# EAGLE design Seeeduino-v4.2 (EAGLE 6.5.0)
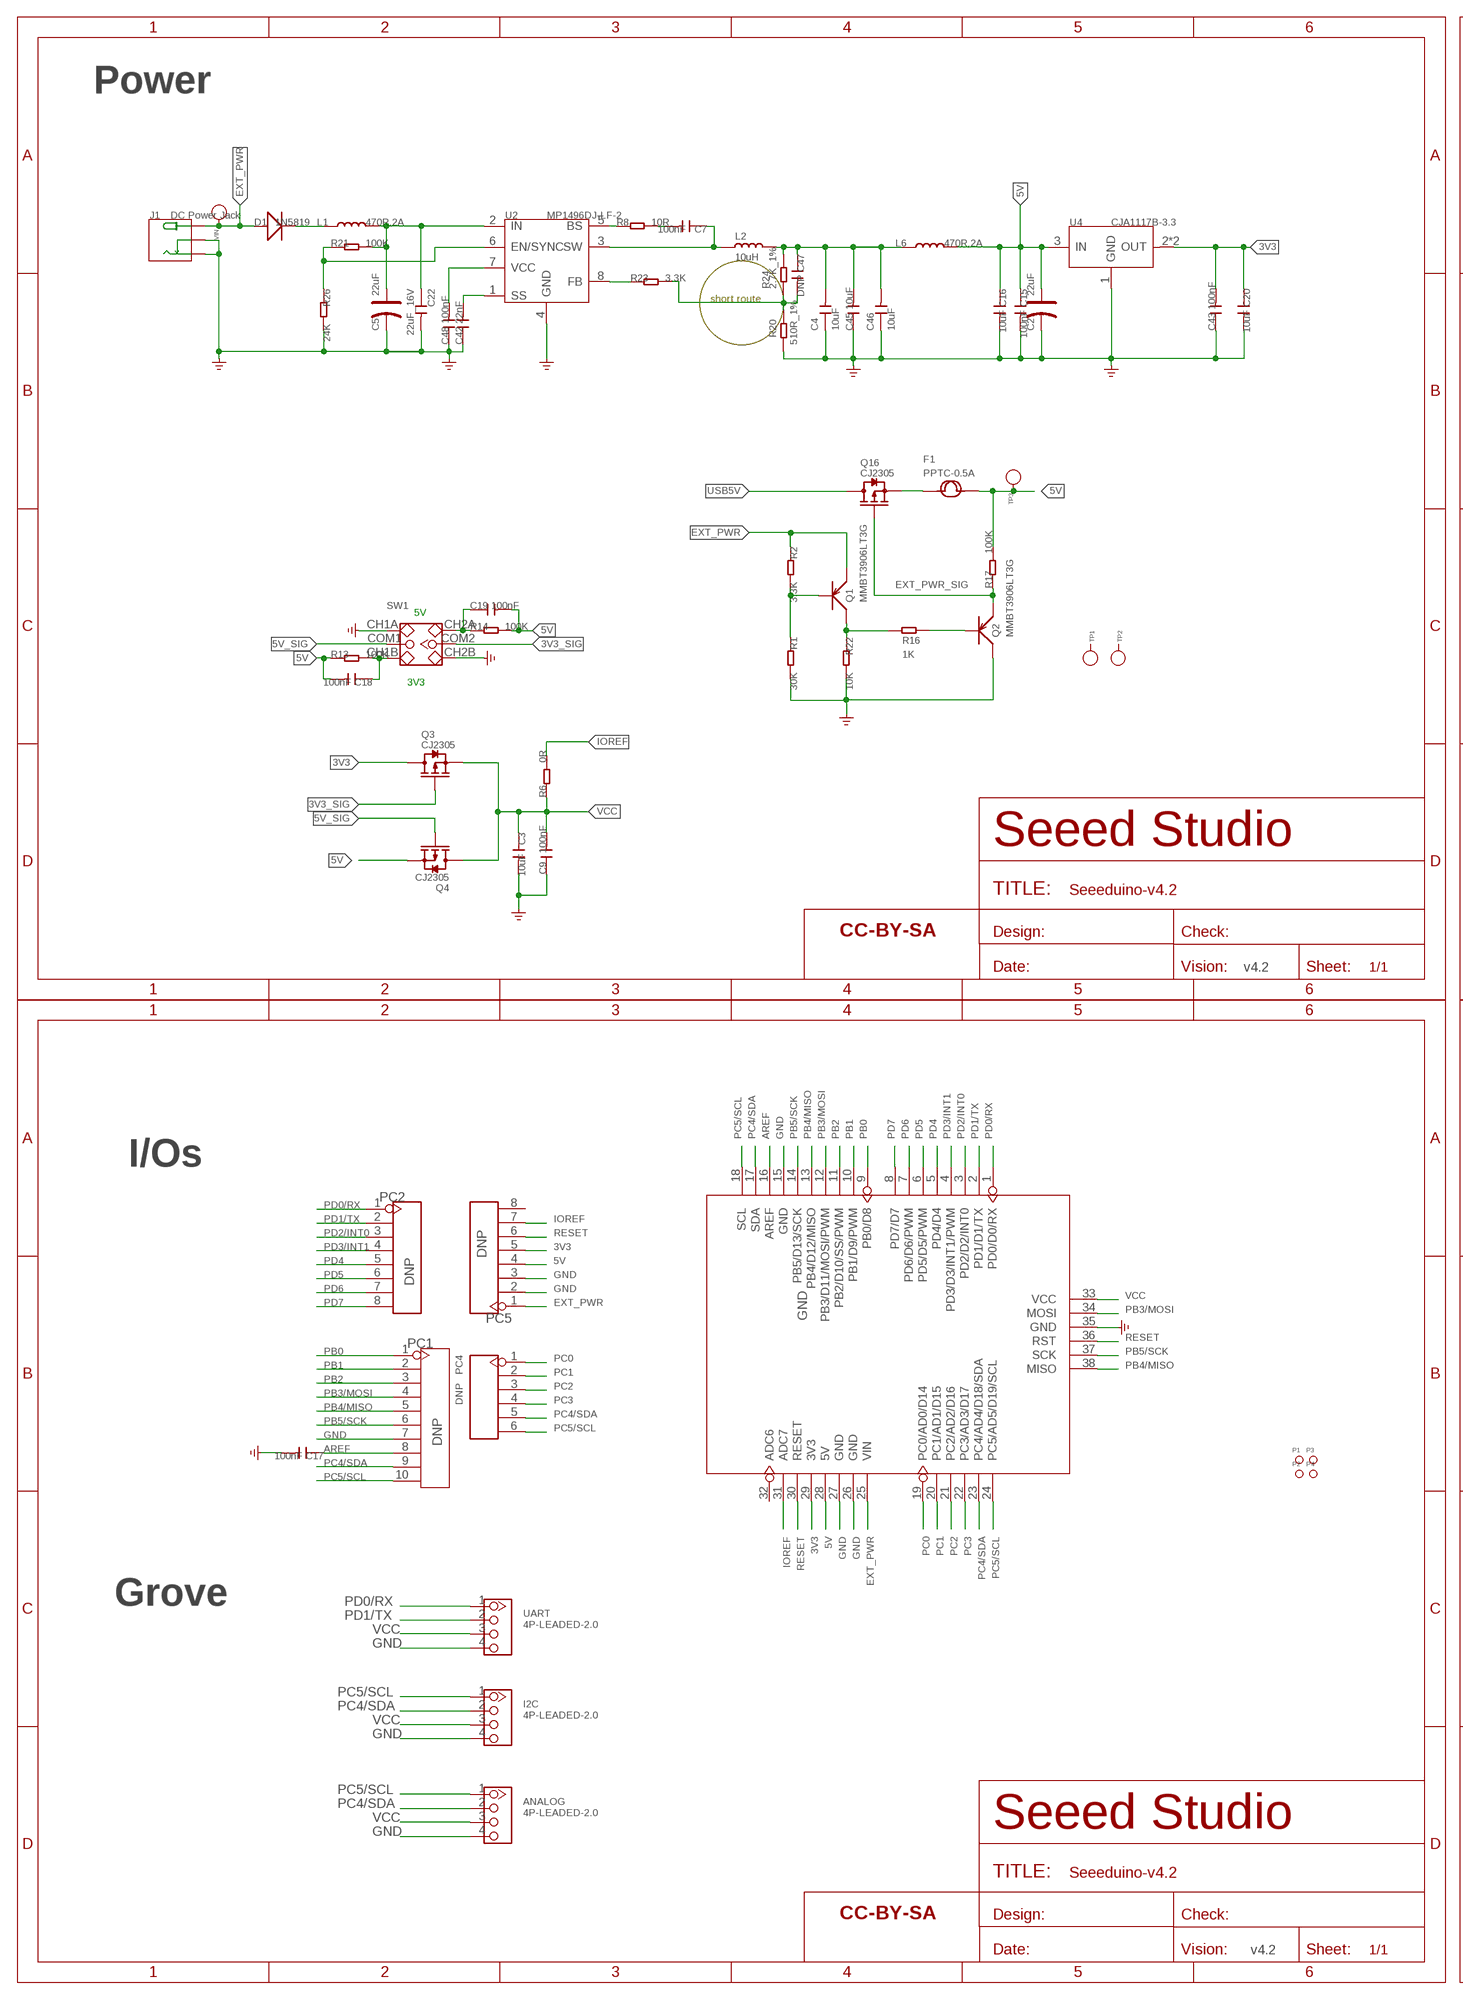
[diagram p0: schematic, sheet 1, part 1 of 2]
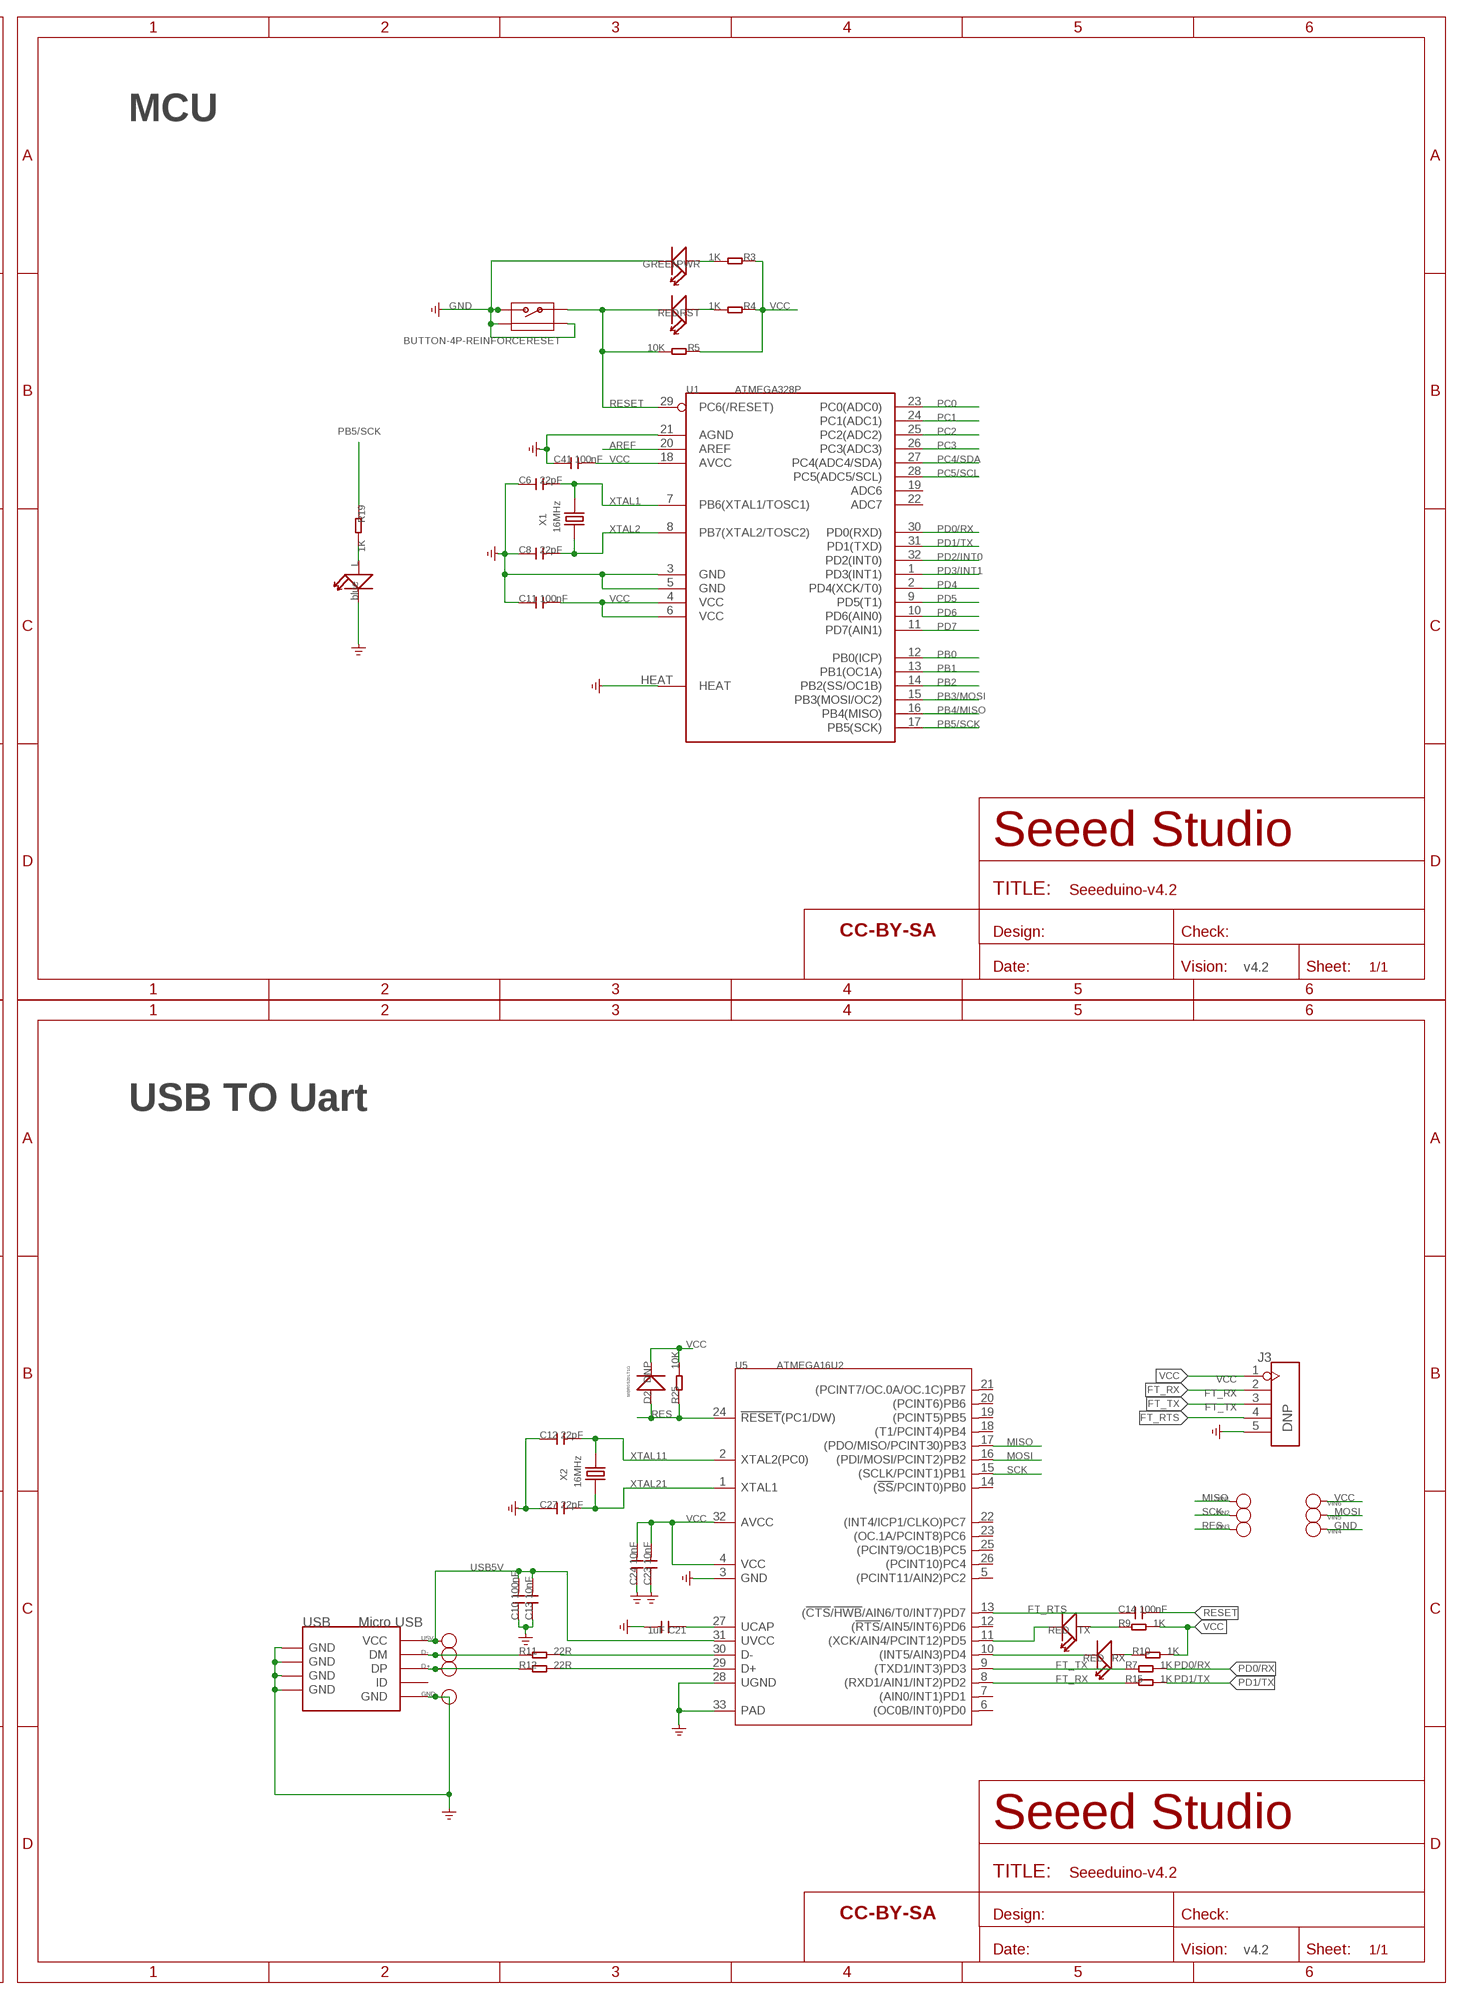
[diagram p1: schematic, sheet 1, part 2 of 2]

## Parts
ANALOG  4P-LEADED-2.0  TWIG-2.0-LEADED  [4P-LEADED-2.0]
C2  22uF  CAP-POLAR-ELECTRO-B  [ELECTRO-SMD-B-4.8MM]
C3  10uF  C-0805  [C0805]
C4  10uF  CAP-0805  [C0805]
C5  22uF  CAP-POLAR-ELECTRO-B  [ELECTRO-SMD-B-4.8MM]
C6  22pF  C-0603  [C0603]
C7  100nF  C-0603  [C0603]
C8  22pF  C-0603  [C0603]
C9  100nF  C-0603  [C0603]
C10  100nF  C-0603  [C0603]
C11  100nF  C-0603  [C0603]
C12  22pF  C-0603  [C0603]
C13  10nF  C-0603  [C0603]
C14  100nF  C-0603  [C0603]
C15  100nF  C-0603  [C0603]
C16  10uF  C-0805  [C0805]
C17  100nF  C-0603  [C0603]
C18  100nF  C-0603  [C0603]
C19  100nF  C-0603  [C0603]
C20  10uF  C-0805  [C0805]
C21  1uF  C-0603  [C0603]
C22  22uF_16V  CAP-1206  [C1206]
C23  10nF  C-0603  [C0603]
C24  10nF  C-0603  [C0603]
C27  22pF  C-0603  [C0603]
C41  100nF  C-0603  [C0603]
C42  22nF  C-0603  [C0603]
C43  100nF  C-0603  [C0603]
C45  10uF  C-0805  [C0805]
C46  10uF  CAP-1206  [C1206]
C47  DNP  C-0603  [C0603]
C48  100nF  C-0603  [C0603]
D1  1N5819  D'DO-214AC'  [D2010]
D2  DNP  D'1206'  [SOD123]
D+  PAD-TEST-POINT'4545'  [TP_4545]
D-  PAD-TEST-POINT'4545'  [TP_4545]
F1  PPTC-0.5A  FUSE'1206'  [F1206]
GND  PAD-TEST-POINT'4545'  [TP_4545]
I2C  4P-LEADED-2.0  TWIG-2.0-LEADED  [4P-LEADED-2.0]
J1  DC Power Jack  DC-044  [DC-404]
J3  DNP  HEADER-5P-2.54  [5P-2.54]
L  blue  LED'0603'  [LED-0603]
L1  470R,2A  L'0805'  [L0805]
L2  10uH  INDUCTOR/FERRITE-BEAD5040S  [L5040S]
L6  470R,2A  L'0805'  [L0805]
P1  PAD-MARK  [ROUND-MARK-1.0]
P2  PAD-MARK  [ROUND-MARK-1.0]
P3  PAD-MARK  [ROUND-MARK-1.0]
P4  PAD-MARK  [ROUND-MARK-1.0]
PC1  DNP  HEADER-10P-2.54  [10P-2.54]
PC2  DNP  HEADER-8P-2.54  [8P-2.54]
PC4  DNP  HEADER-6P-65/35MIL  [6P-2.54-65/35MIL]
PC5  DNP  HEADER-8P-2.54  [8P-2.54]
PWR  GREEN  LED'0603'  [LED-0603]
Q1  MMBT3906LT3G  TRANSISTOR-PNP-SOT23  [SOT23]
Q2  MMBT3906LT3G  TRANSISTOR-PNP-SOT23  [SOT23]
Q3  CJ2305  MOSFET-P'SI2323CDS/SI2305DS<BR>'  [SOT23]
Q4  CJ2305  MOSFET-P'SI2323CDS/SI2305DS<BR>'  [SOT23]
Q16  CJ2305  MOSFET-P'SI2323CDS/SI2305DS<BR>'  [SOT23]
R1  30K  R-0603  [R0603]
R2  3.3K  R-0603  [R0603]
R3  1K  R-0603  [R0603]
R4  1K  R-0603  [R0603]
R5  10K  R-0603  [R0603]
R6  0R  R-0603  [R0603]
R7  1K  R-0603  [R0603]
R8  10R  R-0603  [R0603]
R9  1K  R-0603  [R0603]
R10  1K  R-0603  [R0603]
R11  22R  R-0603  [R0603]
R12  22R  R-0603  [R0603]
R13  100K  R-0603  [R0603]
R14  100K  R-0603  [R0603]
R15  1K  R-0603  [R0603]
R16  1K  R-0603  [R0603]
R17  100K  R-0603  [R0603]
R19  1K  R-0603  [R0603]
R20  510R_1%  R-0603  [R0603]
R21  100K  R-0603  [R0603]
R22  10K  R-0603  [R0603]
R23  3.3K  R-0603  [R0603]
R24  2.7K_1%  R-0603  [R0603]
R25  10K  R-0603  [R0603]
R26  24K  R-0603  [R0603]
RESET  BUTTON-4P-REINFORCE  BUTTON-4P-REINFORCE'TS-1188E'  [4P-SMD-7X3.5X3.5H]
RST  RED  LED'0603'  [LED-0603]
RX  RED  LED'0603'  [LED-0603]
SW1  SWITCH-2CH-6P-2.54  SWITCH-2CH-6P-SMD  [6P-SMD-2CH-2.54-3.5X7.2]
TP1  PAD-TEST-POINT'4545'  [TP_4545]
TP2  PAD-TEST-POINT'4545'  [TP_4545]
TP3  PAD-TEST-POINT'4545'  [TP_4545]
TX  RED  LED'0603'  [LED-0603]
U1  ATMEGA328P  MEGA8  [MLF32X]
U2  MP1496DJ-LF-2  MP1496DJ  [TSOT23-8]
U3  ARDUINO-38P  [ARDUINO-38P]
U4  CJA1117B-3.3  PMIC-CJ1117'SOT89'  [SOT-89]
U5  ATMEGA16U2  [QFN32]
U5V  PAD-TEST-POINT'4545'  [TP_4545]
U$1  SEEEDSTUDIO-OPEN-SCH-FRAME  [SEEEDSTUDIO-PCB-FRAME]
U$6  SEEEDSTUDIO-OPEN-SCH-FRAME  [SEEEDSTUDIO-PCB-FRAME]
U$8  SEEEDSTUDIO-OPEN-SCH-FRAME  [SEEEDSTUDIO-PCB-FRAME]
U$23  SEEEDSTUDIO-OPEN-SCH-FRAME  [SEEEDSTUDIO-PCB-FRAME]
UART  4P-LEADED-2.0  TWIG-2.0-LEADED  [4P-LEADED-2.0]
USB  Micro USB  USB-MINIUSB-5P-MICRO  [MICRO-USB]
VIN  PAD-TEST-POINT'4545'  [TP_4545]
VIN1  PAD-TEST-POINT'4545'  [TP_4545]
VIN2  PAD-TEST-POINT'4545'  [TP_4545]
VIN3  PAD-TEST-POINT'4545'  [TP_4545]
VIN4  PAD-TEST-POINT'4545'  [TP_4545]
VIN5  PAD-TEST-POINT'4545'  [TP_4545]
VIN6  PAD-TEST-POINT'4545'  [TP_4545]
X1  16MHz  CRYSTAL'5032'  [2P-SMD-5X3.2]
X2  16MHz  CRYSTAL'5032'  [2P-SMD-5X3.2]

## Nets
3V3: C20.1 C43.2 PC5.5 Q3.3(D) U3.29(3V3) U4.2(OUT) U4.4(OUT)
3V3_SIG: Q3.1(G) SW1.COM2
5V: C2.+ C15.1 C16.1 C18.2 C19.2 F1.2 L6.2 PC5.4 Q4.2(S) R13.1 R14.2 R17.2 TP3.T U3.28(5V) U4.3(IN)
5V_SIG: Q4.1(G) SW1.COM1
AREF: C17.1 PC1.8 U1.20(AREF) U3.16(AREF)
D+: D+.T R12.1 USB.3(DP)
D-: D-.T R11.1 USB.2(DM)
EXT_PWR: D1.+ J1.+ PC5.1 Q1.2(E) R2.1 U3.25(VIN) VIN.T
EXT_PWR_SIG: Q2.2(E) Q16.1(G) R17.1
FT_RTS: C14.1 J3.4 U5.13((!CTS!/!HWB!/AIN6/T0/INT7)PD7)
FT_RX: J3.2 R15.1 U5.8((RXD1/AIN1/INT2)PD2)
FT_TX: J3.3 R7.1 U5.9((TXD1/INT3)PD3)
GND: ANALOG.4 C2.- C3.2 C4.1 C5.- C6.1 C8.1 C9.1 C10.1 C11.1 C12.1 C13.1 C15.2 C16.2 C17.2 C20.2 C21.2 C22.2 C23.1 C24.1 C27.1 C41.1 C42.1 C43.1 C45.1 C46.1 C48.1 GND.T I2C.4 J1.- J1.CDN J3.5 L.- PC1.7 PC5.2 PC5.3 PWR.- Q2.3(C) R1.2 R20.1 R22.2 R26.2 RESET.2 RESET.S1 RESET.S2 SW1.CH1A SW1.CH2B U1.3(GND) U1.5(GND) U1.21(AGND) U1.HEAT U2.4(GND) U3.15(GND) U3.26(GND) U3.27(GND) U3.35(GND) U4.1(GND) U5.3(GND) U5.28(UGND) U5.33(PAD) UART.4 USB.5(GND) USB.S1(GND) USB.S2(GND) USB.S3(GND) USB.S4(GND) USB.S5(GND) USB.S6(GND) VIN4.T ; supply symbol labelled GND_POWER
IOREF: PC5.7 R6.2 U3.31(ADC7)
MISO: U5.17((PDO/MISO/PCINT30)PB3) VIN1.T
MOSI: U5.16((PDI/MOSI/PCINT2)PB2) VIN5.T
N$1: TX.- U5.11((XCK/AIN4/PCINT12)PD5)
N$2: R21.1 R26.1 U2.6(EN/SYNC)
N$3: L.+ R19.2
N$5: Q1.1(B) R1.1 R2.2
N$6: R11.2 U5.30(D-)
N$7: PWR.+ R3.2
N$8: Q2.1(B) R16.2
N$9: Q1.3(C) R16.1 R22.1
N$10: D1.- L1.1
N$11: C18.1 R13.2 SW1.CH1B
N$12: R10.1 RX.+
N$13: R12.2 U5.29(D+)
N$14: RX.- U5.10((INT5/AIN3)PD4)
N$15: C19.1 R14.1 SW1.CH2A
N$17: R4.2 RST.+
N$18: C21.1 U5.27(UCAP)
N$20: C48.2 U2.7(VCC)
N$21: C42.2 U2.1(SS)
N$22: R8.1 U2.5(BS)
N$23: C7.1 L2.1 U2.3(SW)
N$24: C7.2 R8.2
N$25: R23.1 U2.8(FB)
N$27: C47.2 R20.2 R23.2 R24.2
N$32: R9.1 TX.+
OUT1: C4.2 C45.2 C46.2 C47.1 L2.2 L6.1 R24.1
P5V [usbvcc]: F1.1 Q16.2(S)
PB0: PC1.1 U1.12(PB0(ICP)) U3.9(PB0/D8)
PB1: PC1.2 U1.13(PB1(OC1A)) U3.10(PB1/D9/PWM)
PB2: PC1.3 U1.14(PB2(SS/OC1B)) U3.11(PB2/D10/SS/PWM)
PB3/MOSI: PC1.4 U1.15(PB3(MOSI/OC2)) U3.12(PB3/D11/MOSI/PWM) U3.34(MOSI)
PB4/MISO: PC1.5 U1.16(PB4(MISO)) U3.13(PB4/D12/MISO) U3.38(MISO)
PB5/SCK: PC1.6 R19.1 U1.17(PB5(SCK)) U3.14(PB5/D13/SCK) U3.37(SCK)
PC0: PC4.1 U1.23(PC0(ADC0)) U3.19(PC0/AD0/D14)
PC1: PC4.2 U1.24(PC1(ADC1)) U3.20(PC1/AD1/D15)
PC2: PC4.3 U1.25(PC2(ADC2)) U3.21(PC2/AD2/D16)
PC3: PC4.4 U1.26(PC3(ADC3)) U3.22(PC3/AD3/D17)
PC4/SDA: ANALOG.2 I2C.2 PC1.9 PC4.5 U1.27(PC4(ADC4/SDA)) U3.17(SDA) U3.23(PC4/AD4/D18/SDA)
PC5/SCL: ANALOG.1 I2C.1 PC1.10 PC4.6 U1.28(PC5(ADC5/SCL)) U3.18(SCL) U3.24(PC5/AD5/D19/SCL)
PD0/RX: PC2.1 R7.2 U1.30(PD0(RXD)) U3.1(PD0/D0/RX) UART.1
PD1/TX: PC2.2 R15.2 U1.31(PD1(TXD)) U3.2(PD1/D1/TX) UART.2
PD2/INT0: PC2.3 U1.32(PD2(INT0)) U3.3(PD2/D2/INT0)
PD3/INT1: PC2.4 U1.1(PD3(INT1)) U3.4(PD3/D3/INT1/PWM)
PD4: PC2.5 U1.2(PD4(XCK/T0)) U3.5(PD4/D4)
PD5: PC2.6 U1.9(PD5(T1)) U3.6(PD5/D5/PWM)
PD6: PC2.7 U1.10(PD6(AIN0)) U3.7(PD6/D6/PWM)
PD7: PC2.8 U1.11(PD7(AIN1)) U3.8(PD7/D7)
PWR_IN: C5.+ C22.1 L1.2 R21.2 U2.2(IN)
RES: D2.+ R25.1 U5.24(!RESET!(PC1/DW)) VIN3.T
RESET: C14.2 PC5.6 R5.2 RESET.1 RST.- U1.29(PC6(/RESET)) U3.30(RESET) U3.36(RST)
SCK: U5.15((SCLK/PCINT1)PB1) VIN2.T
USB5V: C10.2 C13.2 Q16.3(D) U5.31(UVCC) U5V.T USB.1(VCC)
VCC: ANALOG.3 C3.1 C9.2 C11.2 C23.2 C24.2 C41.2 D2.- I2C.3 J3.1 Q3.2(S) Q4.3(D) R3.1 R4.1 R5.1 R6.1 R9.2 R10.2 R25.2 U1.4(VCC) U1.6(VCC) U1.18(AVCC) U3.33(VCC) U5.4(VCC) U5.32(AVCC) UART.3 VIN6.T
XTAL1: C6.2 U1.7(PB6(XTAL1/TOSC1)) X1.2
XTAL2: C8.2 U1.8(PB7(XTAL2/TOSC2)) X1.1
XTAL11: C12.2 U5.2(XTAL2(PC0)) X2.2
XTAL21: C27.2 U5.1(XTAL1) X2.1
Unconnected: PC5.8 TP1.T TP2.T U1.19(ADC6) U1.22(ADC7) U3.32(ADC6) U5.5((PCINT11/AIN2)PC2) U5.6((OC0B/INT0)PD0) U5.7((AIN0/INT1)PD1) U5.12((!RTS!/AIN5/INT6)PD6) U5.14((!SS!/PCINT0)PB0) U5.18((T1/PCINT4)PB4) U5.19((PCINT5)PB5) U5.20((PCINT6)PB6) U5.21((PCINT7/OC.0A/OC.1C)PB7) U5.22((INT4/ICP1/CLKO)PC7) U5.23((OC.1A/PCINT8)PC6) U5.25((PCINT9/OC1B)PC5) U5.26((PCINT10)PC4) USB.4(ID)

## Notes on the sheet
- Power
- MCU
- short route
- 5V
- 3V3
- v4.2 | v4.2
- USB TO Uart
- I/Os
- MBR0520LT1G
- Grove
- v4.2 | v4.2

## Library data of the parts
ANALOG I2C UART = Connector:TWIG-2.0-LEADED
C2 C5 = Discrete-new:CAP-POLAR: Electrolytic Capacitors,Tantalum Capacitors and Super Capacitors
C3 C6-C21 C23 C24 C27 C41-C43 C45 C47 C48 = Discrete:C*: Ceramic Capacitors
C4 C22 C46 = Discrete-new:CAP: Ceramic Capacitors
D1 D2 = Discrete:D*
D+ D- GND TP1-TP3 U5V VIN VIN1-VIN6 = Discrete:PAD-TEST-POINT; PARTNO: DNP
F1 = Discrete:FUSE
J1 = For_Test_Albert:DC-044
J3 = Connector:HEADER-5P
L PWR RST RX TX = Discrete:LED*
L1 L6 = Discrete:L*
L2 = Discrete-new:INDUCTOR/FERRITE-BEAD
P1-P4 = Discrete:PAD-MARK; PARTNO: DNP
PC1 = Connector:HEADER-10P
PC2 PC5 = Connector:HEADER-8P
PC4 = Connector:HEADER-6P
Q1 Q2 = Discrete:TRANSISTOR-PNP*: PNP audion
Q3 Q4 Q16 = Discrete:MOSFET-P
R1-R17 R19-R26 = Discrete:R*
RESET = Discrete:BUTTON-4P-REINFORCE: TS-1188E http://www.best-dz.com/?thread-374-2.html
SW1 = Discrete:SWITCH-2CH-6P
U1 = ICs_v54:MEGA8
U2 = template:MP1496DJ: High-Efficiency,2A，16V,500kHz Synchronous,Step-Down Converter http://html.alldatasheetcn.com/html-pdf/551584/MPS/MP1496DJ/55/1/MP1496DJ.html
U3 = moudle:ARDUINO-38P
U4 = IC-new:PMIC-CJ*1117: Low Drop Fixed And Adjustable Positive Voltage Regulators http://www.datasheetcatalog.org/datasheet/SGSThomsonMicroelectronics/mXuqtqv.pdf
U5 = template2:ATMEGA16U2: 8-bit AVR Microcontroller with 8/16/32K Bytes of ISP Flash and USB Controller
U$1 U$6 U$8 U$23 = moudle-new:SEEEDSTUDIO-OPEN-SCH-FRAME
USB = Connector:USB-MINIUSB-5P
X1 X2 = Discrete:CRYSTAL*: CRYSTAL

## Net classes
0 default: width 0.152 mm, clearance 0.152 mm
1 power: width 0.152 mm, drill 0.152 mm, clearance 0.152 mm
2 gnd: width 0.152 mm, drill 0.152 mm, clearance 0.152 mm
3 usbvcc: width 0.152 mm, drill 0.152 mm, clearance 0.152 mm

## Board
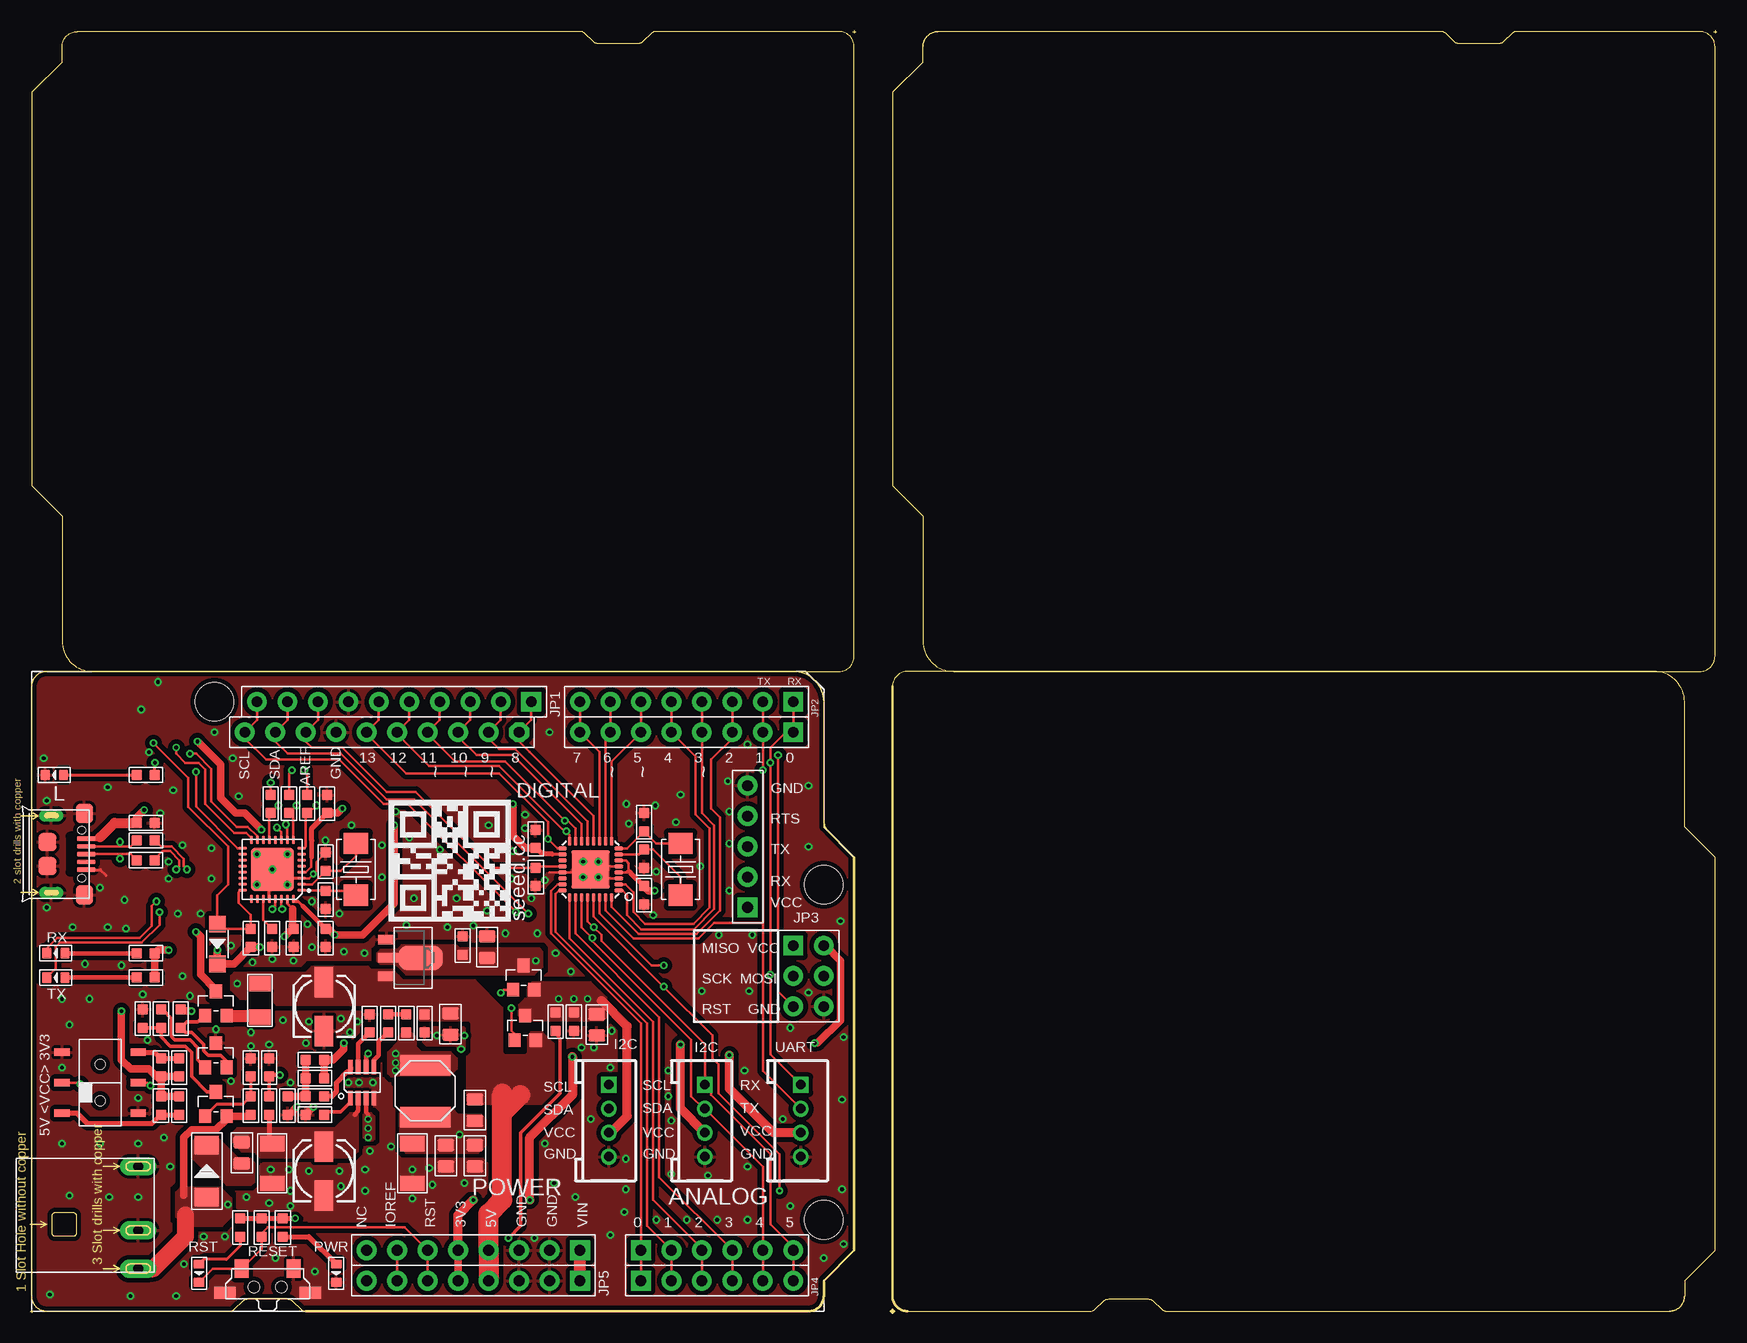
[diagram p2: board, top side]
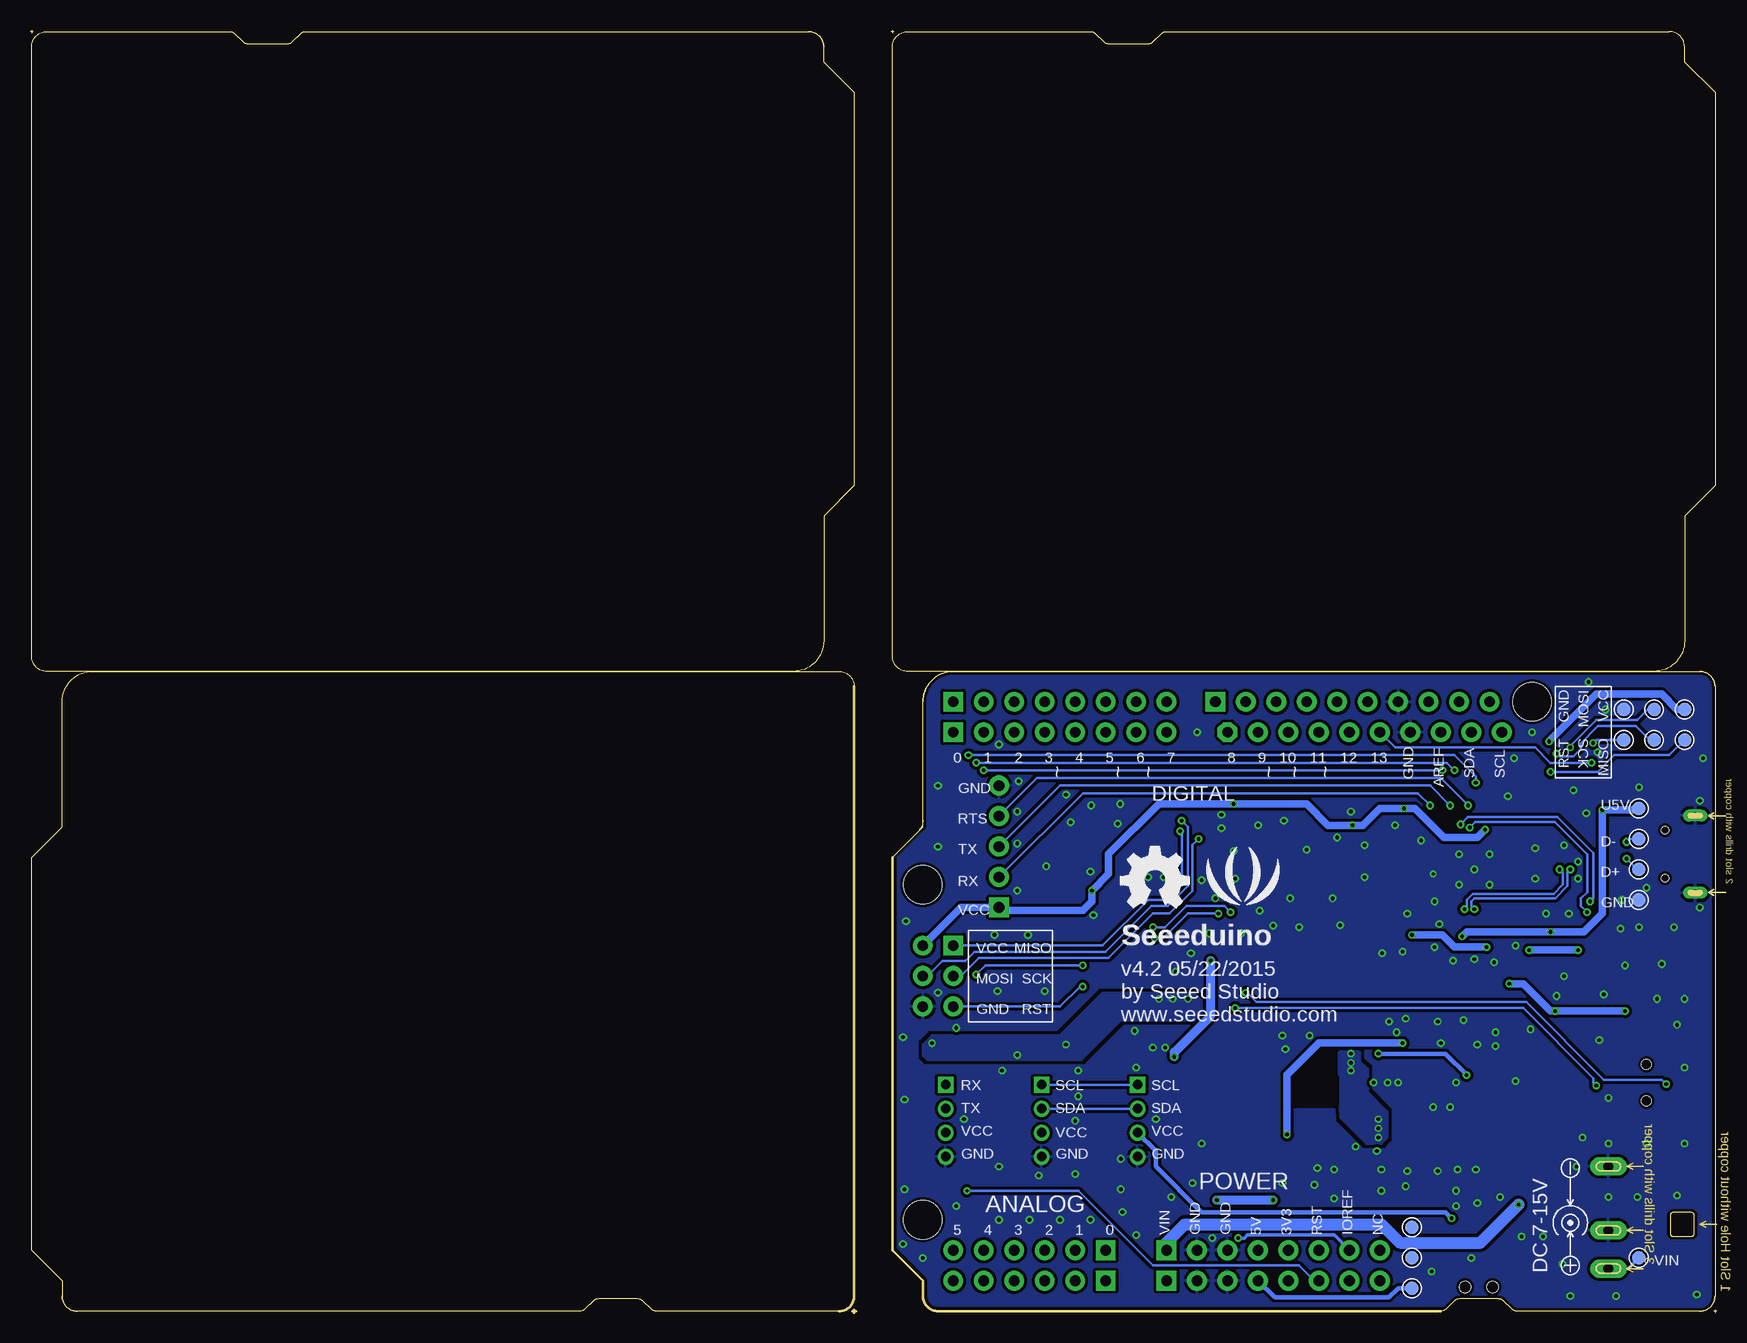
[diagram p3: board, bottom side, seen from below]

Size 140.59 x 106.93 mm. Coordinates in mm from the lower left corner, seen from the top.
Outline: 66.17,41.04 arc45 66.54,40.14 68.71,37.97
Outline: 1.4,0.13 arc-90 0.13,1.4
Outline: 0.13,52.2 arc-90 1.4,53.47
Outline: 63.63,53.47 arc-90 66.17,50.93
Outline: 66.17,1.4 arc-90 64.9,0.13
Outline: 139.19,53.47 arc90 140.46,54.74
Outline: 140.46,105.54 arc90 139.19,106.81
Outline: 75.69,106.81 arc90 74.42,105.54
Outline: 74.42,56.01 arc90 76.96,53.47
Outline: 73.15,53.47 arc90 71.88,52.2
Outline: 137.92,50.93 arc90 135.38,53.47
Outline: 0.13,1.4 arc90 1.4,0.13
Outline: 64.9,0.13 arc90 66.17,1.4
Outline: 73.15,53.47 arc90 71.88,52.2
Outline: 71.88,1.4 arc90 73.15,0.13
Outline: 136.65,0.13 arc90 137.92,1.4
Outline: 137.92,50.93 arc90 135.38,53.47
Outline: 1.4,53.47 arc90 0.13,52.2
Outline: 0.13,1.4 arc90 1.4,0.13
Outline: 64.9,0.13 arc90 66.17,1.4
Outline: 66.17,50.93 arc90 63.63,53.47
Outline: 74.42,105.54 74.42,104.27 71.88,101.73 71.88,68.96 74.42,66.42 74.42,56.01
Outline: 74.42,105.54 arc-90 75.69,106.81
Outline: 76.96,53.47 139.19,53.47
Outline: 139.19,53.47 arc90 140.46,54.74
Outline: 140.46,54.74 140.46,105.54
Outline: 140.46,105.54 arc90 139.19,106.81
Outline: 74.42,56.01 arc90 76.96,53.47
Outline: 66.17,1.4 66.17,2.67 68.71,5.21 68.71,37.97
Outline: 66.17,1.4 arc-90 64.9,0.13
Outline: 63.63,53.47 1.4,53.47
Outline: 1.4,53.47 arc90 0.13,52.2
Outline: 0.13,52.2 0.13,1.4
Outline: 0.13,1.4 arc90 1.4,0.13
Outline: 68.71,37.97 66.17,40.51 66.17,50.93
Outline: 66.17,50.93 arc90 63.63,53.47
Outline: 64.9,0.13 23,0.13 arc-45 22.55,0.31 21.9,0.96 arc45 21.45,1.14 18.17,1.14 arc45 17.72,0.96 17.08,0.31 arc-45 16.63,0.13 1.4,0.13
Outline: 137.92,1.4 137.92,2.67 140.46,5.21 140.46,37.97 137.92,40.51 137.92,50.93
Outline: 137.92,1.4 arc-90 136.65,0.13
Outline: 135.38,53.47 73.15,53.47
Outline: 73.15,53.47 arc90 71.88,52.2
Outline: 71.88,52.2 71.88,1.4
Outline: 71.88,1.4 arc90 73.15,0.13
Outline: 137.92,50.93 arc90 135.38,53.47
Outline: 0,0.13 0.25,0.13
Outline: 0.13,0.25 0.13,0
Outline: 71.75,0.13 72.01,0.13
Outline: 71.88,0.25 71.88,0
Outline: 68.58,106.81 68.83,106.81
Outline: 68.71,106.93 68.71,106.68
Outline: 140.34,106.81 140.59,106.81
Outline: 140.46,106.93 140.46,106.68
Outline: 136.65,0.13 94.75,0.13 arc-45 94.3,0.31 93.66,0.96 arc45 93.21,1.14 89.92,1.14 arc45 89.48,0.96 88.83,0.31 arc-45 88.38,0.13 73.15,0.13
Outline: 75.69,106.81 117.59,106.81 arc-45 118.04,106.62 118.69,105.98 arc45 119.13,105.79 122.42,105.79 arc45 122.87,105.98 123.51,106.62 arc-45 123.96,106.81 139.19,106.81
Outline: 2.67,104.27 2.67,105.54 arc-90 3.94,106.81 45.84,106.81 arc-45 46.29,106.62 46.93,105.98 arc45 47.38,105.79 50.66,105.79 arc45 51.11,105.98 51.76,106.62 arc-45 52.21,106.81 67.44,106.81 arc-90 68.71,105.54 68.71,54.74 arc-90 67.44,53.47 5.21,53.47 arc-90 2.67,56.01 2.67,66.42 0.13,68.96 0.13,101.73 2.67,104.27
Copper layers (1*16): Top 0.035mm / dielectric 1.5mm / Bottom 0.035mm
Design rules "SeeedStudio_2layer_DRU_no_angle_20140221 *": minimum track width 6mil, minimum drill 10mil, track to track 6mil, track to pad 6mil, pad to pad 6mil, via to via 6mil, smd to smd 0mil, copper to edge 10mil, drill to drill 10mil, minimum pad ring 10mil, minimum via ring 6mil, stop-mask expansion 2mil, vias tented up to drill 100mil, thermal gap 10mil
Holes 2.03 mm at 7.75,111.25 132.84,111.25 132.84,-4.32 7.75,-4.32
tRestrict: area 18.3,25.3 to 20.1,26.8; area 30.5,17.3 to 35.4,19.4
bRestrict: area 31.7,17.3 to 35.2,19.7

### Footprints (pad centres in the part's own frame; a part is rotated, then mirrored left to right if it is on the bottom)
4P-LEADED-2.0 = drill 0.8 pad 1.27 square: 1 -3,0 | drill 0.8 pad 1.27: 2 -1,0; 3 1,0; 4 3,0
ELECTRO-SMD-B-4.8MM = smd 2.54 x 1.524: + 2.032,0; - -2.032,0
C0805 = smd 1.016 x 1.397: 1 -0.889,0; 2 0.889,0
C0805' = smd 1.397 x 1.016: 1 0,0.889; 2 0,-0.889
C0603 = smd 0.889 x 0.889: 1 -0.762,0; 2 0.762,0
C1206 = smd 1.27 x 2.032: 1 -1.651,0; 2 1.651,0
D2010 = smd 1.524 x 2.032: + -2.159,0; - 2.159,0
SOD123 = smd 1.397 x 1.397: + -1.651,0; - 1.651,0
TP_4545 = smd 1.143 x 1.143: T 0,0
F1206 = smd 1.27 x 1.778: 1 -1.397,0; 2 1.397,0
DC-404 = drill 0.813 pad 1.524 long: + 3.175,10.16; - -5.334,10.16; CDN 0,10.16
5P-2.54 = drill 0.889 pad 1.651 square: 1 0,5.08 | drill 0.889 pad 1.651: 2 0,2.54; 3 0,0; 4 0,-2.54; 5 0,-5.08
LED-0603 = smd 0.762 x 0.889: + -0.762,0; - 0.762,0
L0805 = smd 1.016 x 1.397: 1 -0.889,0; 2 0.889,0
L5040S = smd 4.2 x 1.7: 1 0,2.175; 2 0,-2.175
ROUND-MARK-1.0 = smd 1.016 x 1.016: P$1 0,0
10P-2.54 = drill 0.889 pad 1.651 octagon: 1 0,11.43 | drill 0.889 pad 1.651: 2 0,8.89; 3 0,6.35; 4 0,3.81; 5 0,1.27; 6 0,-1.27; 7 0,-3.81; 8 0,-6.35; 9 0,-8.89; 10 0,-11.43
8P-2.54 = drill 0.889 pad 1.651 square: 1 0,8.89 | drill 0.889 pad 1.651: 2 0,6.35; 3 0,3.81; 4 0,1.27; 5 0,-1.27; 6 0,-3.81; 7 0,-6.35; 8 0,-8.89
6P-2.54-65/35MIL = drill 0.889 pad 1.651 square: 1 0,6.35 | drill 0.889 pad 1.651: 2 0,3.81; 3 0,1.27; 4 0,-1.27; 5 0,-3.81; 6 0,-6.35
SOT23 = smd 1.016 x 1.143: 1 -0.889,-1.016; 2 0.889,-1.016; 3 0,1.016
R0603 = smd 0.889 x 0.889: 1 -0.762,0; 2 0.762,0
4P-SMD-7X3.5X3.5H = smd 1.143 x 1.524: 1 -2.159,1.524; 2 2.159,1.524 | smd 1.778 x 1.016: S1 -3.556,-0.508; S2 3.556,-0.508 | hole 0.95: -1.15,0; 1.15,0
6P-SMD-2CH-2.54-3.5X7.2 = smd 1.27 x 0.635: CH1A -3.175,2.54; CH1B -3.175,-2.54; CH2A 3.175,2.54; CH2B 3.175,-2.54; COM1 -3.175,0; COM2 3.175,0 | hole 0.813: 0,1.524; 0,-1.524
MLF32X = smd 0.7 x 0.3: 1 -2.35,1.75; 2 -2.35,1.25; 3 -2.35,0.75; 4 -2.35,0.25; 5 -2.35,-0.25; 6 -2.35,-0.75; 7 -2.35,-1.25; 8 -2.35,-1.75; 17 2.35,-1.75; 18 2.35,-1.25; 19 2.35,-0.75; 20 2.35,-0.25; 21 2.35,0.25; 22 2.35,0.75; 23 2.35,1.25; 24 2.35,1.75 | smd 0.3 x 0.7: 9 -1.75,-2.35; 10 -1.25,-2.35; 11 -0.75,-2.35; 12 -0.25,-2.35; 13 0.25,-2.35; 14 0.75,-2.35; 15 1.25,-2.35; 16 1.75,-2.35; 25 1.75,2.35; 26 1.25,2.35; 27 0.75,2.35; 28 0.25,2.35; 29 -0.25,2.35; 30 -0.75,2.35; 31 -1.25,2.35; 32 -1.75,2.35 | smd 3.175 x 3.175: HEAT 0,0
TSOT23-8 = smd 0.4 x 1.2: 1 -0.975,-1.3; 2 -0.325,-1.3; 3 0.325,-1.3; 4 0.975,-1.3; 5 0.975,1.3; 6 0.325,1.3; 7 -0.325,1.3; 8 -0.975,1.3
ARDUINO-38P = drill 0.889 pad 1.651 square: 1 63.5,50.8; 9 41.656,50.8; 19 50.8,2.54; 25 45.72,2.54; 38 63.5,30.48 | drill 0.889 pad 1.651: 2 60.96,50.8; 3 58.42,50.8; 4 55.88,50.8; 5 53.34,50.8; 6 50.8,50.8; 7 48.26,50.8; 8 45.72,50.8; 10 39.116,50.8; 11 36.576,50.8; 12 34.036,50.8; 13 31.496,50.8; 14 28.956,50.8; 15 26.416,50.8; 16 23.876,50.8; 17 21.336,50.8; 18 18.796,50.8; 20 53.34,2.54; 21 55.88,2.54; 22 58.42,2.54; 23 60.96,2.54; 24 63.5,2.54; 26 43.18,2.54; 27 40.64,2.54; 28 38.1,2.54; 29 35.56,2.54; 30 33.02,2.54; 31 30.48,2.54; 32 27.94,2.54; 33 66.04,30.48; 34 66.04,27.94; 35 66.04,25.4; 36 63.5,25.4; 37 63.5,27.94 | hole 3.2: 15.24,50.8; 66.04,35.56; 66.04,7.62
SOT-89 = smd 0.8 x 1.4: 1 -1.524,-1.905; 3 1.524,-1.905 | smd 0.8 x 1.9: 2 0,-1.651 | smd 2.032 x 3.65: 4 0,0.94
QFN32 = smd 0.7 x 0.25: 1 -2.45,1.75; 2 -2.45,1.25; 3 -2.45,0.75; 4 -2.45,0.25; 5 -2.45,-0.25; 6 -2.45,-0.75; 7 -2.45,-1.25; 8 -2.45,-1.75; 17 2.45,-1.75; 18 2.45,-1.25; 19 2.45,-0.75; 20 2.45,-0.25; 21 2.45,0.25; 22 2.45,0.75; 23 2.45,1.25; 24 2.45,1.75 | smd 0.25 x 0.7: 9 -1.75,-2.45; 10 -1.25,-2.45; 11 -0.75,-2.45; 12 -0.25,-2.45; 13 0.25,-2.45; 14 0.75,-2.45; 15 1.25,-2.45; 16 1.75,-2.45; 25 1.75,2.45; 26 1.25,2.45; 27 0.75,2.45; 28 0.25,2.45; 29 -0.25,2.45; 30 -0.75,2.45; 31 -1.25,2.45; 32 -1.75,2.45 | smd 3.6 x 3.6: 33 0,0
MICRO-USB = smd 0.381 x 1.524: 1 -1.3,-0.25; 2 -0.65,-0.25; 3 0,-0.25; 4 0.65,-0.25; 5 1.3,-0.25 | smd 1.6 x 1.397: S1 -3.4,-0.427; S6 3.4,-0.427 | drill 0.508 pad 1.016 long: S2 -3.226,-3.175; S5 3.226,-3.175 | smd 1.5 x 1.5: S3 -1,-3.5; S4 1,-3.5 | hole 0.635: -2,-0.65; 2,-0.65
2P-SMD-5X3.2 = smd 1.778 x 2.032: 1 -2.159,0; 2 2.159,0

### Placement (x,y rotation side)
ANALOG  48.26,16 270 top
C2  24.51,25.53 90 top
C3  47.24,24 270 top
C4  10uF  [C0805']  34.67,13.08 180 top
C5  24.51,11.81 90 top
C6  51.18,37.85 90 top
C7  31.37,24.13 90 top
C8  51.18,40.89 270 top
C9  45.34,24.26 90 top
C10  9.65,40.83 180 top
C11  42.16,39.5 270 top
C12  24.64,37.59 270 top
C13  21.97,31.24 90 top
C14  20.07,42.42 90 top
C15  32.89,24.13 270 top
C16  35.05,24.07 270 top
C17  42.16,36.32 270 top
C18  12.45,20.45 270 top
C19  12.45,17.27 90 top
C20  38.1,30.48 90 top
C21  20.19,31.24 270 top
C22  20.19,12.45 270 top
C23  24.64,31.24 90 top
C24  24.77,42.42 270 top
C27  24.64,34.42 90 top
C41  51.18,34.8 90 top
C42  23.75,16.51 0 top
C43  36.07,30.61 270 top
C45  37.08,13.08 90 top
C46  31.88,12.45 90 top
C47  23.75,21.08 180 top
C48  28.32,24.13 270 top
D1  14.73,11.81 90 top
D2  15.62,30.73 270 top
D+  6.48,36.96 0 bottom
D-  6.48,39.5 0 bottom
F1  19.18,26.04 90 top
GND  6.48,34.42 0 bottom
I2C  56.26,16 270 top
J1  -1.14,6.86 270 top
J3  59.82,38.86 180 top
L  2.03,44.83 180 top
L1  17.65,13.34 90 top
L2  32.96,18.48 0 top
L6  37.08,16.89 90 top
P1  2.67,-4.32 0 top  (outside the outline)
P2  137.92,-4.32 0 top  (outside the outline)
P3  2.67,111.25 0 top  (outside the outline)
P4  137.92,111.25 0 top  (outside the outline)
PC1  29.34,48.39 270 top
PC2  54.74,48.39 270 top
PC4  57.28,5.21 90 top
PC5  36.96,5.21 270 top
PWR  25.53,3.3 270 top
Q1  15.49,17.4 0 top
Q2  15.49,21.46 0 top
Q3  41.15,27.94 0 top
Q4  41.28,23.75 0 top
Q16  15.49,25.78 0 top
R1  18.41,20.45 90 top
R2  18.41,17.27 90 top
R3  21.08,7.11 270 top
R4  17.53,7.11 270 top
R5  19.3,7.11 270 top
R6  43.82,24.26 270 top
R7  21.59,42.42 90 top
R8  29.84,24.13 90 top
R9  9.65,27.94 0 top
R10  9.65,29.97 0 top
R11  9.65,39.37 0 top
R12  9.65,37.72 0 top
R13  10.92,20.45 90 top
R14  10.92,17.27 90 top
R15  23.11,42.42 90 top
R16  10.92,24.51 90 top
R17  12.57,24.51 90 top
R19  9.65,44.83 180 top
R20  21.46,17.27 90 top
R21  19.94,17.27 270 top
R22  9.4,24.51 90 top
R23  23.75,18.03 180 top
R24  23.75,19.56 180 top
R25  18.41,31.24 270 top
R26  19.94,20.45 90 top
RESET  19.81,2.16 0 top
RST  14.1,3.3 270 top
RX  2.16,29.97 180 top
SW1  5.84,19.18 180 top
TP1  25.4,7.11 270 bottom
TP2  25.4,4.57 270 bottom
TP3  25.4,2.03 270 bottom
TX  2.16,27.94 180 top
U1  46.74,36.96 180 top
U2  27.69,19.18 0 top
U3  0.13,0.13 0 top
U4  31.62,29.59 270 top
U5  20.19,36.96 180 top
U5V  6.48,42.04 0 bottom
U$1  -1.68,-19.18 0 top  (outside the outline)
U$2  [SEEED-MASK-280*268MIL]  4.7,48.26 0 top
U$4  [LOGO_SILK]  39.5,35.69 0 bottom
U$5  [OSHW_FILLX200_NOTEXT]  49.66,33.78 0 bottom
U$6  -1.77,-44.45 0 top  (outside the outline)
U$8  -1.61,-35.31 0 top  (outside the outline)
U$23  -1.71,-26.67 0 top  (outside the outline)
UART  64.26,16 270 top
USB  4.95,38.23 270 top
VIN  6.48,4.57 0 bottom
VIN1  2.67,47.75 0 bottom
VIN2  5.21,47.75 0 bottom
VIN3  7.75,47.75 0 bottom
VIN4  7.75,50.29 0 bottom
VIN5  5.21,50.29 0 bottom
VIN6  2.67,50.29 0 bottom
X1  54.23,36.96 270 top
X2  27.18,36.96 90 top

### Tracks (layer width: path | path; a pad name or v marks a point on that pad's centre or on a via)
3V3  (via drill 0.3)
  Top 0.61: U3.29 PC5.5
  Top 0.762: PC5.5 35.69,8.13 v36.96,9.4 | v41.66,9.4 41.66,14.61 45.21,18.16 v45.21,21.34
  Bottom 0.762: v41.66,9.4 v36.96,9.4 | v45.21,21.34 45.21,21.72 42.16,24.77 v42.16,29.34
  pour Top (isolate 0.254, no thermals): 29.21,30.23 30.61,30.23 30.99,30.61 35.56,30.61 35.81,30.35 42.42,30.35 42.67,30.1 42.67,28.83 42.04,28.19 31.37,28.19 30.61,28.96 30.48,29.08 29.21,29.08 28.96,29.34 28.96,29.97
3V3_SIG  (via drill 0.3)
  Top 0.203: Q3.1 39.5,26.92 v39.24,26.67 | SW1.COM2 4.06,19.18 v4.19,19.05
  Bottom 0.203: v39.24,26.67 39.12,26.67 38.35,25.91 15.88,25.91 9.4,19.43 4.57,19.43 v4.19,19.05
5V  (via drill 0.3)
  Top 0.61: C19.2 R14.2 R13.1 | R13.1 C18.2 | R13.1 10.54,19.68 9.91,20.32 8.38,20.32 7.62,21.08 v7.62,25.15 | v13.46,25.15 12.57,25.15 R17.2
  Top 1.676: 39.37,16.64 39.37,9.4 38.23,8.26 PC5.4 U3.28 | 39.37,16.64 39.37,18.29 | 39.37,16.64 40.89,18.16
  Bottom 0.381: TP3.T 26.54,2.03 27.3,1.27 36.83,1.27 U3.28
  Bottom 0.61: v7.62,25.15 v13.46,25.15 13.84,25.15 16.13,27.43 v17.27,27.43
  pour Top (isolate 0.254, no thermals): 17.27,28.32 22.99,28.32 23.49,28.83 28.19,28.83 28.45,28.57 30.23,28.57 30.73,28.07 31.11,27.69 37.08,27.69 39.37,25.4 39.37,21.72 39.62,21.46 41.28,21.46 41.53,21.72 41.53,23.11 41.78,23.37 42.67,23.37 43.31,22.73 43.56,22.48 43.82,22.22 43.82,18.54 42.67,17.4 36.7,17.4 36.45,17.65 36.45,21.34 36.83,21.72 36.83,24.13 36.58,24.38 32.51,24.38 32.39,24.51 32.39,25.27 32,25.65 20.57,25.65 20.07,26.16 17.53,26.16 16.76,26.92 16.76,28.07 17.02,28.32
5V_SIG  (via drill 0.3)
  Top 0.203: Q4.1 40.39,23.24 40.13,23.49 v40.13,25.4 | SW1.COM1 9.78,19.18 v10.03,18.92
  Bottom 0.203: v40.13,25.4 16.13,25.4 10.29,19.56 10.29,19.18 v10.03,18.92
AREF
  Top 0.203: U1.20 42.29,37.21 C17.1 38.48,37.08 32.13,43.43 29.72,43.43 26.04,47.12 23.49,47.12 22.99,47.62 PC1.8 24,49.4 U3.16
D+  (via drill 0.3 pad 0.64)
  Top 0.203: USB.3 7.49,38.23 | 7.49,38.23 8.38,38.23 R12.1 | 7.49,38.23 v7.49,37.85
  Bottom 0.203: D+.T 6.6,36.96 v7.49,37.85
D-  (via drill 0.3 pad 0.64)
  Top 0.203: USB.2 7.49,38.88 | 7.49,38.88 8.4,38.88 R11.1 | v7.49,39.24 7.49,38.88
  Bottom 0.203: D-.T 7.24,39.5 v7.49,39.24
EXT_PWR  (via drill 0.3)
  Top 0.61: 12.83,9.78 12.83,14.61 13.46,15.24 15.49,15.24 16.38,16.13 Q1.2 18.29,16.38 R2.1
  Top 1.016: U3.25 PC5.1
  Top 1.422: J1.+ 10.29,3.68 12.95,6.35 12.95,8.13
  Bottom 0.305: J1.+ 7.37,3.68 VIN.T
  Bottom 1.016: PC5.1 45.85,5.84 44.32,7.37 27.94,7.37 26.42,5.84 19.68,5.84 v16.51,9.02
  pour Top (isolate 0.254, no thermals): 12.57,10.41 15.88,10.41 16.76,9.53 16.76,8 16,7.24 12.95,7.24 12.19,8 12.19,10.03
EXT_PWR_SIG
  Top 0.305: Q2.2 16.38,20.95 15.88,21.46 14.86,21.46 14.48,21.84 14.48,22.38 13.49,23.37 12.95,23.37 R17.1 13.08,24.26 13.97,24.26 14.48,24.77 Q16.1
FT_RTS  (via drill 0.3 pad 0.64)
  Top 0.203: U5.13 19.94,41.53 C14.1 20.13,41.66 20.13,41.72 v20.7,42.29
  Bottom 0.203: J3.4 56.64,44.58 22.99,44.58 v20.7,42.29
FT_RX  (via drill 0.3 pad 0.64)
  Top 0.203: U5.8 22.83,38.71 22.99,38.86 22.99,41.53 R15.1 23.24,41.66 v23.88,42.29
  Bottom 0.203: J3.2 52.83,43.31 24.89,43.31 v23.88,42.29
FT_TX  (via drill 0.3 pad 0.64)
  Top 0.203: U5.9 21.94,41.3 R7.1 21.65,41.66 21.65,41.72 v22.22,42.29
  Bottom 0.203: J3.3 54.74,43.94 23.88,43.94 v22.22,42.29
GND  (via drill 0.25, 0.3, 0.3 pad 0.64)
  Top 0.203: U1.3 47.49,36.21 v47.37,36.32 | U1.5 47.76,37.21 v47.37,37.59 46.86,37.08 46.74,37.08 U1.HEAT | v46.1,36.32 45.72,36.71 U1.21 43.31,36.71 | U5.3 23.25,36.21 v23.62,36.58 23.88,36.83 23.88,37.59 C12.1
  Top 0.254: U5.3 20.94,36.21 U5.33 19.94,36.71 U5.28 | USB.5 5.87,36.93 6.35,36.45
  Top 0.305: C10.1 10.41,40.89
  Top 0.61: C42.1 v23.62,17.14 | R20.1 21.59,16.51 v22.22,17.14
  other vias: 46.1,37.59 52.13,42.29 52.2,36.77 51.94,33.15 6.6,9.65 12.19,1.4 20.45,4.57 9.02,17.91 15.49,23.62 11.68,12.19 11.18,14.61 46.74,16.13 20.19,29.46 16.76,30.61 56.52,11.43 59.56,20.19 56.01,26.8 59.82,12.19 59.82,7.75 57.28,7.75 54.74,7.75 52.2,7.75 2.67,26.16 2.67,20.45 2.67,14.1 9.02,14.1 9.02,9.65 31.88,11.94 45.47,9.65 48.39,20.45 18.92,38.23 21.46,38.23 21.46,35.69 18.92,35.69 20.19,36.96 14.22,33.27 26.8,40.64 7.87,34.42 15.11,36.2 12.7,28.07 49.91,40.77 53.85,40.89 31.37,32.32 24.64,39.37 25.78,33.27 33.53,10.67 38.1,33.53 49.66,12.83 46.99,22.1 53.47,16 53.47,11.56 64.9,43.94 64.9,38.86 43.31,48.39 5.84,35.43 10.86,41.66 12.7,38.99 12.32,33.27 11.56,36.2 11.56,37.59 17.4,43.05 6.48,32.13 23.49,34.29 15.37,48.39 10.67,52.58 1.14,46.23 1.4,33.78 1.4,42.67 22.99,22.48 49.66,10.29 27.88,29.97 19.94,22.35 33.27,12.07 59.94,26.8 64.9,26.67 43.69,10.79 62.74,16.13 58.17,44.32 3.56,32.13 21.97,29.34 25.78,11.81 3.3,9.78 25.91,10.54 18.41,22.22 15.11,38.73 27.43,19.18 4.95,26.16 5.84,14.1 4.57,29.08 7.62,28.96 14.48,6.35 16.26,6.35 12.83,4.06 8.38,1.4 20.07,11.94 23.24,11.81 27.94,11.94 27.94,10.16 21.72,10.16 23.11,32.39 6.48,43.82 8,32 39.62,31.62 33.91,23.11 45.97,22.1 43.82,29.97 34.8,32.13 29.34,38.99 29.34,36.32 25.91,24.51 36.2,23.11 42.93,36.07 41.28,40.39 35.56,34.54 40.13,36.2 41.78,34.54 11.94,43.56 26.16,30.1 34.16,38.61 32,34.54 36.96,32.26 36.2,10.79 23.24,24.26 16.76,19.3 31.88,9.53 38.23,40.64 28.57,19.18 21.59,11.94 48.39,6.48 49.72,42.42 31.62,39.62 36.07,41.02 40.26,38.48 30.48,41.78 55.88,37.21 57.4,31.5 60.2,31.5 58.29,35.18 58.29,39.12 58.29,41.78 59.82,47.37 3.3,24 23.49,30.48 42.04,6.22 49.53,8.38 26.54,19.18 30.1,13.84 28.32,13.46 48.51,23.49 35.94,21.97 21.08,24.38 18.41,23.37 18.03,9.65 19.94,9.14 21.72,8.89 1.65,1.52 45.09,28.45 42.29,31.62 18.54,29.21 13.34,26.42 9.4,26.54 9.78,22.73 42.93,14.1 41.28,41.53 26.67,23.37 23.75,3.43 27.3,24.26 21.72,19.18 53.21,20.19 63.37,8.89 67.69,10.29 67.69,17.78 67.82,22.99 63.37,23.75 66.17,4.57 67.82,5.71 67.56,32.64 16.89,46.23 9.91,46.74 54.23,43.18 9.27,50.29 53.21,18.03
  pour Top (isolate 0.381, rank 6): 0.13,53.47 68.71,53.47 68.71,0.13 0.13,0.13
  pour Bottom (isolate 0.254, rank 6): 0.13,53.47 68.71,53.47 68.71,0.13 0.13,0.13
  pour Top (isolate 0.254, no thermals): 26.54,19.56 29.46,19.56 30.35,18.67 30.35,13.46 30.99,12.83 37.72,12.83 38.1,12.45 38.1,10.41 37.85,10.16 36.45,10.16 34.8,8.51 34.8,6.86 34.42,6.48 32.64,6.48 31.5,7.62 23.24,7.62 22.35,8.51 17.53,8.51 17.27,8.76 17.27,9.91 17.4,10.03 18.54,10.03 19.18,10.67 19.18,12.19 19.43,12.45 23.37,12.45 23.62,12.19 26.8,12.19 27.81,13.21 27.81,13.59 28.07,13.84 28.83,13.84 29.21,14.22 29.21,16.76 28.57,17.4 28.57,18.67 28.45,18.8 26.42,18.8 26.29,18.92 26.29,19.3
IOREF  (via drill 0.3)
  Top 0.203: U3.31 PC5.7
  Top 0.305: R6.2 43.82,23.24 44.2,22.86 44.2,18.29 40.89,14.99 40.89,7.24 v39.88,6.22
  Bottom 0.305: v39.88,6.22 39.37,6.22 39.12,6.48 31.88,6.48 PC5.7
MISO  (via drill 0.3 pad 0.64)
  Top 0.203: U5.17 17.33,38.71 13.84,42.2 v13.84,45.09
  Bottom 0.203: VIN1.T 3.94,46.48 8.51,46.48 9.91,45.09 v13.84,45.09
MOSI  (via drill 0.3)
  Top 0.203: U5.16 18.44,39.6 18.03,40.01 17.03,40.01 14.61,42.43 14.61,45.31 14.07,45.85 12.95,45.85 12.19,46.61 v12.19,47.12
  Bottom 0.203: VIN5.T 5.71,50.29 6.6,49.4 10.04,49.4 12.19,47.25 v12.19,47.12
N$1  (via drill 0.3 pad 0.64)
  Top 0.203: U5.11 20.94,40.08 v20.57,40.45 | TX.- 2.16,28.7 2.16,30.48 2.54,30.86 9.31,30.86 10.79,32.35 v10.79,33.4
  Bottom 0.203: v20.57,40.45 20.13,40.89 13.47,40.89 10.79,38.22 10.79,35.05 11.3,34.54 11.3,33.91 v10.79,33.4
N$2  (via drill 0.3)
  Top 0.305: R21.1 R26.1
  Top 0.381: U2.6 28.01,21.41 v28.19,21.59 | v20.83,19.81 20.07,19.81 R26.1
  Bottom 0.381: v28.19,21.59 22.61,21.59 v20.83,19.81
N$3
  Top 0.254: L.+ R19.2
N$5
  Top 0.254: R1.1 R2.2 17.78,17.4 15.62,17.4 Q1.1
N$6  (via drill 0.3 pad 0.64)
  Top 0.203: U5.30 20.94,33.73 v21.02,33.66 | v13.08,36.96 12.83,37.21 12.83,37.85 11.81,38.86 10.92,38.86 R11.2
  Bottom 0.203: 12.95,36.83 v13.08,36.96 12.83,36.7 12.83,35.69 13.59,34.93 20.32,34.93 20.83,34.42 20.83,33.85 v21.02,33.66
N$7
  Top 0.406: R3.2 23.24,6.35 PWR.+
N$8
  Top 0.305: R16.2 11.05,25.27 11.81,24.51 11.81,22.99 12.07,22.73 13.34,22.73 13.97,22.1 13.97,21.08 Q2.1
N$9
  Top 0.305: Q1.3 14.73,18.41 13.46,19.68 13.46,21.72 12.95,22.22 11.68,22.22 10.92,22.99 R16.1 R22.1
N$10
  pour Top (isolate 0.254, no thermals): 13.84,14.61 15.62,14.61 17.4,12.83 18.41,12.83 18.67,12.45 18.67,10.92 18.41,10.67 16.38,10.67 14.99,12.07 14.35,12.07 13.46,12.95 13.46,14.22
N$11
  Top 0.406: SW1.CH1B 10.41,21.72 R13.2 C18.1 12.57,21.21
N$12
  Top 0.381: RX.+ R10.1
N$13  (via drill 0.3 pad 0.64)
  Top 0.203: U5.29 20.44,33.91 v20.19,33.66 | v12.19,36.96 12.45,37.21 12.45,37.72 11.68,38.48 11.05,38.48 10.41,37.85 R12.2
  Bottom 0.203: v20.19,33.66 20.45,33.91 20.45,34.29 20.19,34.54 13.46,34.54 12.45,35.56 12.45,36.7 v12.19,36.96
N$14  (via drill 0.3 pad 0.64)
  Top 0.203: U5.10 21.44,40.6 v21.34,40.7 | RX.- 1.4,30.35 2.29,31.24 9.14,31.24 10.16,32.26 10.16,33.91 v10.54,34.29
  Bottom 0.203: v10.54,34.29 10.29,34.54 10.29,38.34 13.26,41.31 20.73,41.31 v21.34,40.7
N$15
  Top 0.406: C19.1 R14.1 10.16,15.75 4.83,15.75 3.94,16.64 SW1.CH2A
N$17
  Top 0.254: R4.2 17.53,5.59 16.38,4.44 14.48,4.44 RST.+
N$18
  Top 0.203: U5.27 19.44,32.75 C21.1
N$20
  Top 0.381: U2.7 27.36,22.41 C48.2
N$21
  Top 0.305: U2.1 26.71,17.57 25.91,16.76 24.77,16.76 C42.2
N$22
  Top 0.381: U2.5 28.66,21.04 29.08,21.46 29.08,22.61 R8.1
N$23  (via drill 0.3)
  Top 0.381: U2.3 28.01,16.69 28.19,16.51
  other vias: 30.48,20.83 30.48,21.59 30.48,20.19 28.19,16.13 28.19,15.37 28.19,14.61
  pour Top (isolate 0.254, no thermals): 27.94,16.64 28.45,16.64 28.7,16.38 28.7,14.48 28.57,14.35 28.07,14.35 27.81,14.61 27.81,16.51
  pour Top (isolate 0.254, no thermals): 30.1,19.68 34.93,19.68 35.56,20.32 35.56,21.21 35.05,21.72 32.64,21.72 32.13,22.22 32.13,22.99 31.88,23.24 30.99,23.24 30.73,22.99 30.73,22.61 29.84,21.72 29.84,19.94
  pour Bottom (isolate 0.254): 29.97,21.97 31.24,21.97 31.5,21.72 31.5,19.56 31.37,16.26 29.21,14.1 27.94,14.1 27.43,14.61 27.43,16.76 29.08,18.41 29.08,20.32 29.72,20.95 29.72,21.72
N$24
  Top 0.381: R8.2 C7.2
N$25
  Top 0.406: U2.8 26.71,20.23 26.54,20.07 26.42,20.07 25.53,19.18 25.53,18.41 25.15,18.03 R23.1
N$27
  Top 0.61: C47.2 R24.2 R23.2 R20.2
N$32
  Top 0.381: TX.+ R9.1
OUT1  (via drill 0.3)
  Top 0.61: R24.1 C47.1 25.27,21.08 26.16,21.97 v26.16,22.48
  Bottom 0.61: v35.81,14.86 35.81,19.81 33.15,22.48 v26.16,22.48
  pour Top (isolate 0.254, no thermals): 30.86,17.02 35.18,17.02 35.69,16.51 37.59,16.51 37.97,16.13 37.97,13.97 37.34,13.34 31.37,13.34 30.86,13.84
P5V
  Top 1.016: Q16.2 19.05,24.77 F1.1
PB0
  Top 0.203: U3.9 41.78,49.4 PC1.1 40.77,47.62 41.66,46.74 46.99,41.41 U1.12
PB1
  Top 0.203: U3.10 39.24,49.4 PC1.2 38.23,47.88 39.12,46.99 40.45,46.99 46.49,40.96 U1.13
PB2
  Top 0.203: U3.11 36.7,49.4 PC1.3 35.69,48.01 37.21,46.48 40.24,46.48 45.99,40.73 U1.14
PB3/MOSI  (via drill 0.3)
  Top 0.203: U3.12 34.16,49.4 PC1.4 33.15,48.26 35.43,45.97 39.62,45.97 v44.58,41.02 44.83,41.02 45.49,40.37 U1.15
  Bottom 0.203: U3.34 65.79,28.07 64.52,29.34 62.61,29.34 61.85,30.1 50.93,30.1 47.12,33.91 45.72,33.91 44.07,35.56 44.07,40.51 v44.58,41.02
PB4/MISO  (via drill 0.3)
  Top 0.203: U3.13 31.62,49.4 PC1.5 30.61,48.26 33.27,45.59 39.12,45.59 44.58,40.13 v44.7,40.13 44.99,39.85 U1.16
  Bottom 0.203: v44.7,40.13 44.58,40.01 44.58,35.69 45.85,34.42 47.37,34.42 51.18,30.61 U3.38
PB5/SCK  (via drill 0.3, 0.3 pad 0.64)
  Top 0.203: U3.14 29.08,49.4 PC1.6 28.07,48.26 31.37,44.96 39.12,44.96 43.18,40.89 v43.18,39.5 43.97,38.71 U1.17
  Top 0.254: R19.1 v10.41,45.85
  Bottom 0.203: PC1.6 26.8,47.12 15.11,47.12 13.84,45.85 v10.41,45.85 | v43.18,39.5 43.69,38.99 43.69,35.18 45.59,33.27 46.99,33.27 50.67,29.59 61.47,29.59 62.99,28.07 U3.37
PC0
  Top 0.203: U3.19 PC4.1 50.93,24.13 43.43,31.62 43.43,35.18 43.96,35.71 U1.23
PC1
  Top 0.203: U3.20 PC4.2 51.44,7.24 51.44,24.13 43.82,31.75 43.82,34.93 44.1,35.21 U1.24
PC2
  Top 0.203: U3.21 PC4.3 56.01,5.33 51.94,9.4 51.94,24.26 44.99,31.21 U1.25
PC3
  Top 0.203: U3.22 PC4.4 52.45,11.3 52.45,24.64 45.49,31.6 U1.26
PC4/SDA  (via drill 0.3)
  Top 0.203: U3.23 PC4.5 61.09,12.18 I2C.2 56.13,17.02 55.12,18.03 55.12,22.73 46.86,30.99 v46.86,31.24 45.99,32.12 U1.27 | U3.17 21.46,49.4 PC1.9 20.45,47.62 21.46,46.61 25.91,46.61 29.72,42.8 32,42.8 v41.53,33.27
  Bottom 0.203: ANALOG.2 I2C.2 | v41.53,33.27 44.07,33.27 46.1,31.24 v46.86,31.24
PC5/SCL  (via drill 0.3)
  Top 0.203: U3.24 PC4.6 63.63,5.46 61.72,7.37 61.72,13.21 56.77,18.16 56.77,18.49 I2C.1 56.26,22.35 47.62,30.99 47.62,31.5 v46.99,32.13 46.49,32.64 U1.28 | U3.18 18.92,49.4 PC1.10 17.91,47.88 19.68,46.1 25.78,46.1 29.46,42.42 31.5,42.42 v40.51,33.4 40.26,33.66
  Bottom 0.203: ANALOG.1 I2C.1 | v40.51,33.4 41.02,33.91 44.2,33.91 45.97,32.13 v46.99,32.13
PD0/RX  (via drill 0.3, 0.3 pad 0.64)
  Top 0.203: U3.1 PC2.1 62.99,48.39 61.72,47.12 v61.72,45.85 v61.72,28.19 61.72,21.54 UART.1 | R7.2 21.59,44.96 v21.84,45.21 | U1.30 47.49,33.29 51.82,28.96 v52.83,28.96
  Bottom 0.203: v61.72,45.85 22.48,45.85 v21.84,45.21 | v52.83,28.96 60.96,28.96 v61.72,28.19
PD1/TX  (via drill 0.3 pad 0.64)
  Top 0.203: 61.09,32.51 v61.09,45.21 PC2.2 U3.2 | 61.09,32.51 61.09,20.18 UART.2 | 61.09,32.51 57.02,32.51 55.72,31.21 50.32,31.21 47.99,33.55 U1.31 | R15.2 23.11,44.96 v22.86,45.21
  Bottom 0.203: v61.09,45.21 v22.86,45.21
PD2/INT0
  Top 0.203: U3.3 PC2.3 58.55,47.88 56.77,46.1 56.77,42.04 57.53,41.28 57.53,33.55 55.55,31.58 50.72,31.58 48.49,33.81 U1.32
PD3/INT1
  Top 0.203: U3.4 PC2.4 56.01,41.66 57.02,40.64 57.02,33.66 55.34,31.97 50.96,31.97 49.78,33.15 49.78,34.8 49.38,35.21 U1.1
PD4
  Top 0.203: U1.2 49.64,35.71 50.29,35.05 50.29,33.4 51.26,32.43 55.29,32.43 56.64,33.78 56.64,40.39 55.5,41.53 55.5,46.36 PC2.5 U3.5
PD5
  Top 0.203: U3.6 PC2.6 48.49,45.95 U1.9
PD6
  Top 0.203: U3.7 PC2.7 47.99,47.99 U1.10
PD7
  Top 0.203: U3.8 PC2.8 47.49,46.75 U1.11
PWR_IN
  Top 0.381: U2.2 27.36,16.82 27.05,16.51
  Top 0.406: R21.2 19.94,14.73
  pour Top (isolate 0.254, no thermals): 17.27,15.37 25.4,15.37 26.67,16.64 27.3,16.64 27.3,13.46 26.8,12.95 19.18,12.95 18.67,13.46 17.65,13.46 16.89,14.22 16.89,14.99
RES  (via drill 0.3)
  Top 0.203: R25.1 18.54,32 | R25.1 16,32 D2.+ 15.62,34.8 16.51,35.69 16.51,38.86 13.21,42.16 13.21,44.58 v10.29,47.5 | U5.24 17.55,35.21 17.4,35.05 17.4,34.16 18.41,33.15 R25.1
  Bottom 0.203: VIN3.T 10.03,47.75 v10.29,47.5
RESET  (via drill 0.25, 0.3, 0.3 pad 0.64)
  Top 0.203: U3.30 PC5.6 31.24,7.11 19.81,7.11 19.3,6.6 R5.2 19.3,5.33 RESET.1 15.24,3.68 RST.- | v62.36,46.48 62.36,26.8 U3.36 | U1.29 46.99,33.02 v52.83,27.18 56.9,23.11 56.9,21.21 57.4,20.7 57.4,18.29 62.48,13.21 v62.48,10.16 | v20.07,44.2 C14.2
  Bottom 0.203: v62.36,46.48 21.84,46.48 20.07,44.7 v20.07,44.2 | 52.71,27.05 v52.83,27.18 53.09,27.18 54.74,25.53 U3.36 | U3.30 33.53,2.67 34.8,3.94 46.99,3.94 53.21,10.16 v62.48,10.16
SCK  (via drill 0.3)
  Top 0.203: U5.15 18.94,39.73 18.16,40.51 17.23,40.51 15.11,42.63 15.11,45.34 13.84,46.61 v13.34,46.61
  Bottom 0.203: VIN2.T 5.59,47.75 6.73,48.9 9.88,48.9 11.3,47.48 11.3,46.99 11.94,46.36 13.08,46.36 v13.34,46.61
USB5V  (via drill 0.3)
  Top 0.254: U5.31 21.44,34.12 21.91,33.66
  Top 0.406: USB.1 5.75,39.53 5.84,39.62
  Top 0.61: C10.2 8.89,41.28 v9.53,41.91 | 21.91,33.66 21.91,32.07 C13.2 21.84,32 v21.21,31.37 | Q16.3 15.49,26.92 14.22,28.19 14.22,31.37 v13.84,31.75
  Top 0.813: 5.84,39.62 7.05,40.83 C10.2
  Bottom 0.61: U5V.T 6.6,41.91 v9.53,41.91 9.53,33.27 11.05,31.75 v13.84,31.75 20.83,31.75 v21.21,31.37
VCC  (via drill 0.3)
  Top 0.203: U1.4 49.66,36.71 | 49.66,36.71 49.91,36.71 49.91,36.83 | U1.6 49.67,37.71 49.91,37.47 49.91,36.96 | 49.91,36.96 49.91,36.83 | 49.91,36.83 50.03,36.71 | 49.66,36.71 49.91,36.96 | U5.4 22.99,36.71 23.43,37.15 23.43,37.91 23.49,37.97
  Top 0.254: U5.32 21.94,34.45 22.1,34.29 22.35,34.29 22.73,33.91 | U1.18 43.58,38.21 43.56,38.23
  Top 0.381: 23.49,37.97 23.49,39.37 | 22.73,33.91 C23.2
  Top 0.406: 43.56,38.23 42.67,38.23 C11.2 | 50.03,36.71 C41.2 | R4.1 R5.1 R3.1 v22.1,7.87 | 23.49,39.37 23.49,40.39 C24.2
  Top 0.61: R9.2 R10.2 10.67,30.23 v11.56,30.23 | C11.2 41.28,38.73 40.26,39.75 v40.26,42.42 | v52.07,35.18 51.56,35.18 C41.2 | C23.2 24.89,32 v25.4,31.5 27.75,31.5 30.35,34.1 v30.35,40.64 | v19.18,30.48 R25.2 17.02,29.08 D2.- v15.62,30.23 | I2C.3 56.25,15 | U3.33 66.29,30.61 67.56,29.34 67.56,24.38 65.66,22.48 v65.41,22.48 | C24.2 25.65,41.66 v26.04,42.04 | v13.97,47.62 15.88,45.72 15.88,42.93 17.14,41.66 17.91,41.66 v19.3,40.26
  Top 0.762: ANALOG.3 48.4,15 49.78,16.38 49.78,23.88 47.62,26.04 | 56.25,15 54.23,17.02 v54.23,22.35 | UART.3 61.96,15 58.29,18.67 v58.29,21.46
  Bottom 0.381: ANALOG.3 46.74,13.48 46.74,12.19 42.93,8.38 22.61,8.38 v22.1,7.87
  Bottom 0.61: U3.33 62.99,33.78 J3.1 59.56,33.53 52.83,33.53 52.07,34.29 v52.07,35.18 50.67,36.58 50.67,38.23 46.48,42.42 v40.26,42.42 34.16,42.42 32.39,40.64 v30.35,40.64 29.46,40.64 28.07,42.04 v26.04,42.04 25.15,42.04 22.73,39.62 19.94,39.62 v19.3,40.26 | v25.4,31.5 22.86,31.5 21.84,30.48 v19.18,30.48 | v15.62,30.23 v11.56,30.23 | VIN6.T 3.3,50.29 4.58,51.58 10.02,51.58 v13.97,47.62
  other vias: 45.34,26.16 44.07,26.16 46.48,26.16
  pour Top (isolate 0.254, no thermals): 41.91,27.56 46.74,27.56 48.01,26.29 48.01,24.64 47.75,24.38 41.15,24.38 40.77,24.77 40.77,25.65 41.28,26.16 41.4,26.16 41.53,26.29 41.53,27.18
  pour Bottom (isolate 0.254): 43.56,26.67 51.18,26.67 54.48,23.37 54.74,23.11 65.41,23.11 66.17,22.35 66.17,21.46 65.79,21.08 52.96,21.08 49.66,24.38 43.56,24.38 42.93,25.02 42.93,26.04
XTAL1
  Top 0.203: U1.7 50.78,38.21 C6.2 51.94,38.61 54.23,36.32 X1.2
XTAL2
  Top 0.203: U1.8 49.76,38.71 C8.2 52.2,39.12 X1.1
XTAL11
  Top 0.203: U5.2 23.52,35.71 C12.2 25.91,36.83 27.18,38.1 X2.2
XTAL21
  Top 0.203: U5.1 24.61,35.21 | C27.2 26.8,35.18
  Top 0.254: 24.61,35.21 C27.2 | 26.8,35.18 X2.1

### Text on the board
tPlace: TX | RX | 13 | 12 | 11 | 10 | 9 | 8 | 7 | 6 | 5 | 4 | 3 | 2 | 1 | 0 | SCL | SDA | AREF | GND | ~ | ~ | ~ | ~ | ~ | ~ | DIGITAL | GND | RTS | TX | RX | VCC | seeed.cc | MISO | VCC | SCK | MOSI | RST | GND | I2C | SCL | SCL | RX | SDA | TX | SDA | 5V <VCC> 3V3 | VCC | VCC | VCC | GND | GND | GND | POWER | ANALOG | NC | IOREF | RST | 3V3 | 5V | GND | GND | VIN | 0 | 1 | 2 | 3 | 4 | 5
bPlace: VCC | MOSI | GND | MISO | SCK | RST | 13 | 12 | 11 | 10 | 9 | 8 | 7 | 6 | 5 | 4 | 3 | 2 | 1 | 0 | SCL | SDA | AREF | GND | ~ | ~ | ~ | ~ | ~ | ~ | DIGITAL | GND | RTS | TX | RX | VCC | Seeeduino | MISO | VCC | v4.2 05/22/2015 | SCK | MOSI | by Seeed Studio | RST | GND | www.seeedstudio.com | SCL | SCL | RX | SDA | SDA | TX | VCC | VCC | VCC | GND | GND | GND | POWER | ANALOG | NC | IOREF | RST | 3V3 | 5V | GND | GND | VIN | 0 | 1 | 2 | 3 | 4 | 5 | DC 7-15V